# EAGLE design fat-mic-array (EAGLE 7.5.0)
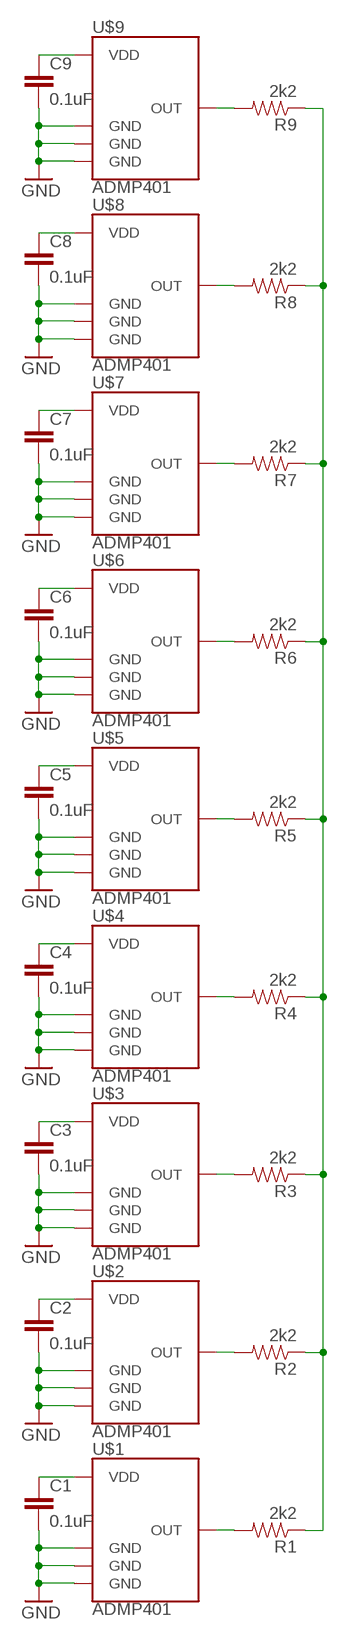
[diagram p0: schematic, sheet 1]

## Parts
C1  0.1uF  0.1UF-16V(+-10%)(0402)  [0402-CAP]
C2  0.1uF  0.1UF-16V(+-10%)(0402)  [0402-CAP]
C3  0.1uF  0.1UF-16V(+-10%)(0402)  [0402-CAP]
C4  0.1uF  0.1UF-16V(+-10%)(0402)  [0402-CAP]
C5  0.1uF  0.1UF-16V(+-10%)(0402)  [0402-CAP]
C6  0.1uF  0.1UF-16V(+-10%)(0402)  [0402-CAP]
C7  0.1uF  0.1UF-16V(+-10%)(0402)  [0402-CAP]
C8  0.1uF  0.1UF-16V(+-10%)(0402)  [0402-CAP]
C9  0.1uF  0.1UF-16V(+-10%)(0402)  [0402-CAP]
R1  2k2  RESISTOR0402-RES  [0402-RES]
R2  2k2  RESISTOR0402-RES  [0402-RES]
R3  2k2  RESISTOR0402-RES  [0402-RES]
R4  2k2  RESISTOR0402-RES  [0402-RES]
R5  2k2  RESISTOR0402-RES  [0402-RES]
R6  2k2  RESISTOR0402-RES  [0402-RES]
R7  2k2  RESISTOR0402-RES  [0402-RES]
R8  2k2  RESISTOR0402-RES  [0402-RES]
R9  2k2  RESISTOR0402-RES  [0402-RES]
U$1  ADMP401  [ADMP401]
U$2  ADMP401  [ADMP401]
U$3  ADMP401  [ADMP401]
U$4  ADMP401  [ADMP401]
U$5  ADMP401  [ADMP401]
U$6  ADMP401  [ADMP401]
U$7  ADMP401  [ADMP401]
U$8  ADMP401  [ADMP401]
U$9  ADMP401  [ADMP401]

## Nets
GND: C1.2 C2.2 C3.2 C4.2 C5.2 C6.2 C7.2 C8.2 C9.2 U$1.2(GND) U$1.4(GND) U$1.6(GND) U$2.2(GND) U$2.4(GND) U$2.6(GND) U$3.2(GND) U$3.4(GND) U$3.6(GND) U$4.2(GND) U$4.4(GND) U$4.6(GND) U$5.2(GND) U$5.4(GND) U$5.6(GND) U$6.2(GND) U$6.4(GND) U$6.6(GND) U$7.2(GND) U$7.4(GND) U$7.6(GND) U$8.2(GND) U$8.4(GND) U$8.6(GND) U$9.2(GND) U$9.4(GND) U$9.6(GND)
N$1: R1.2 U$1.1(OUT)
N$2: C1.1 U$1.5(VDD)
N$3: R3.2 U$3.1(OUT)
N$4: R1.1 R2.1 R3.1 R4.1 R5.1 R6.1 R7.1 R8.1 R9.1
N$5: R2.2 U$2.1(OUT)
N$6: C2.1 U$2.5(VDD)
N$8: C3.1 U$3.5(VDD)
N$10: R4.2 U$4.1(OUT)
N$11: C4.1 U$4.5(VDD)
N$13: R5.2 U$5.1(OUT)
N$14: C5.1 U$5.5(VDD)
N$16: R6.2 U$6.1(OUT)
N$17: C6.1 U$6.5(VDD)
N$18: R7.2 U$7.1(OUT)
N$19: C7.1 U$7.5(VDD)
N$20: R8.2 U$8.1(OUT)
N$21: C8.1 U$8.5(VDD)
N$22: R9.2 U$9.1(OUT)
N$23: C9.1 U$9.5(VDD)

## Library data of the parts
C1-C9 = SparkFun-Capacitors:0.1UF-16V(+-10%)(0402); PROD_ID: CAP-12416
R1-R9 = SparkFun-Passives:RESISTOR: Resistor Basic schematic elements and footprints for 0603, 1206, and PTH resistors.
U$1-U$9 = SparkFun-Sensors:ADMP401: Omnidirection bottom-port MEMS microphone

## Board
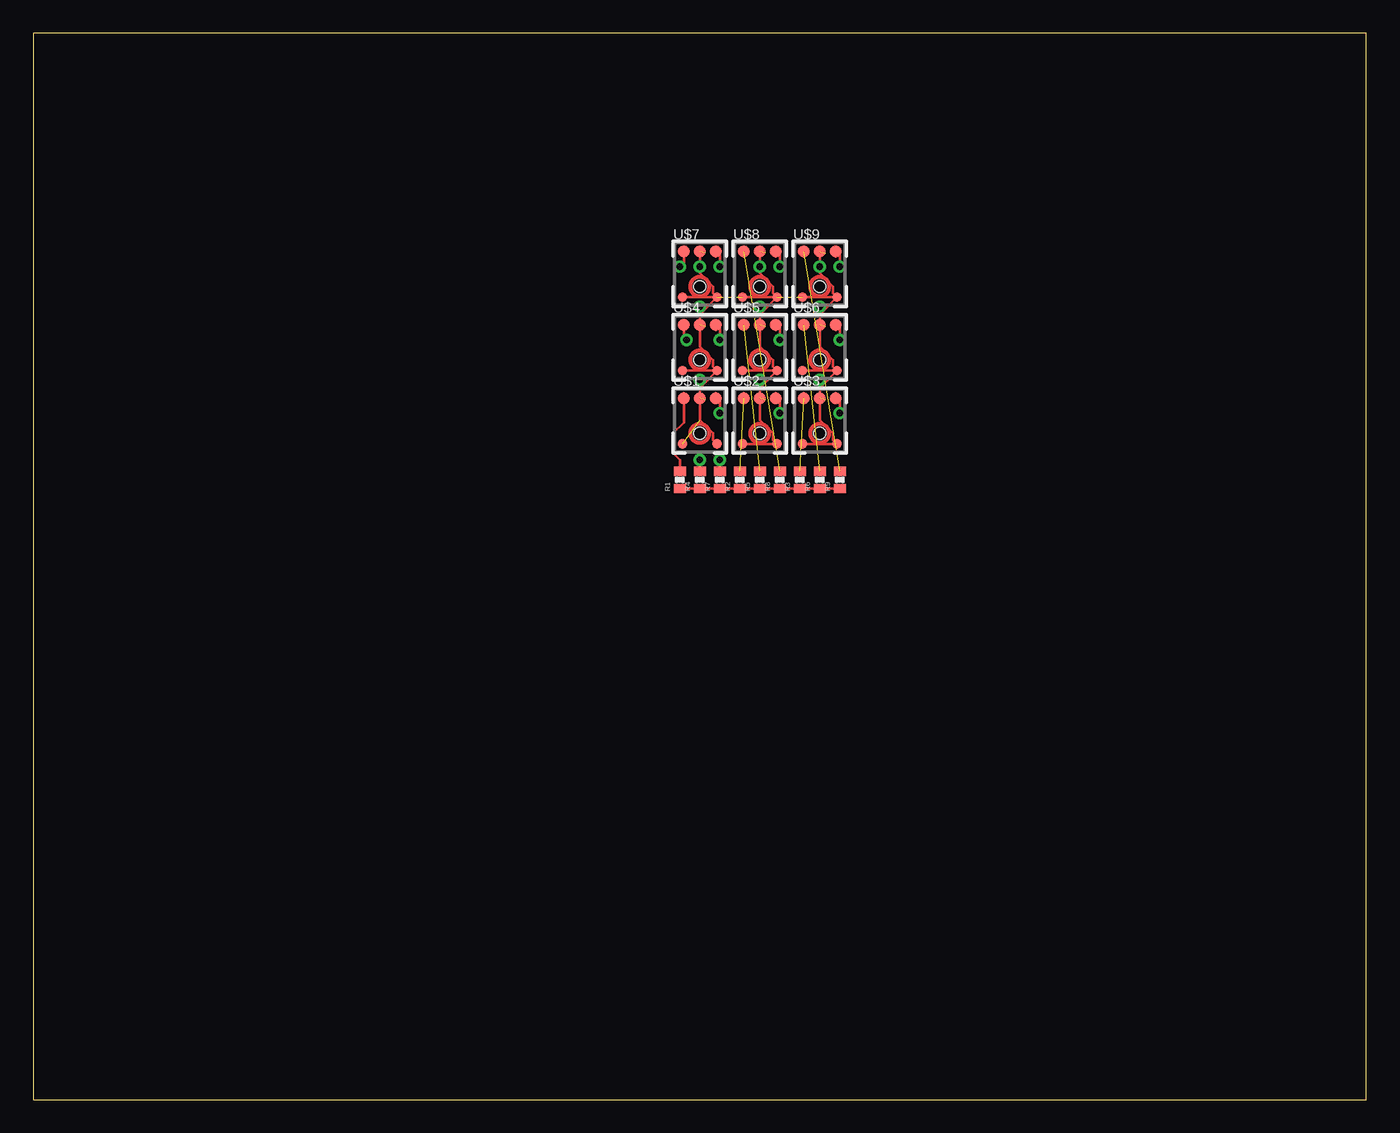
[diagram p1: board, top side]
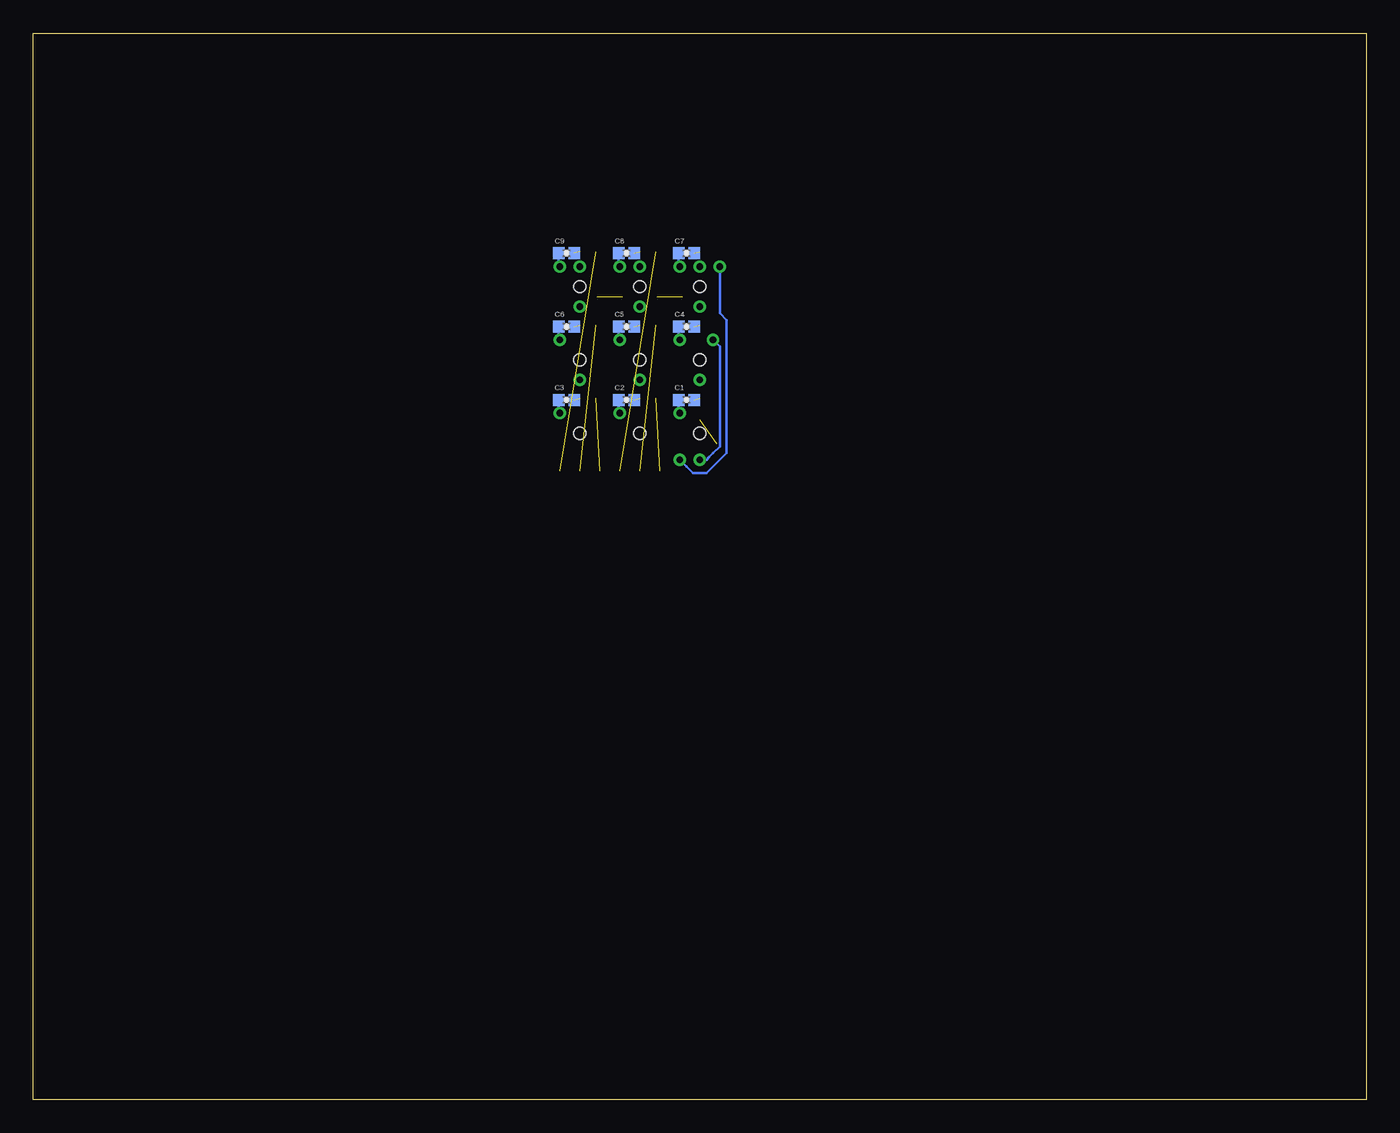
[diagram p2: board, bottom side, seen from below]

Size 100 x 80 mm. Coordinates in mm from the lower left corner, seen from the top.
Outline: 0,0 100,0 100,80 0,80 0,0
Copper layers (1*16): Top 0.035mm / dielectric 1.5mm / Bottom 0.035mm
Design rules "default": minimum track width 10mil, minimum drill 24mil, track to track 8mil, track to pad 8mil, pad to pad 8mil, via to via 8mil, smd to smd 8mil, copper to edge 40mil, drill to drill 8mil, minimum pad ring 10mil, minimum via ring 8mil, stop-mask expansion 4mil, vias tented up to drill 0mil, thermal gap 10mil

### Footprints (pad centres in the part's own frame; a part is rotated, then mirrored left to right if it is on the bottom)
0402-CAP = smd 0.85 x 0.9: 1 -0.58,0; 2 0.58,0
0402-RES = smd 0.7 x 0.9: 1 -0.65,0; 2 0.65,0
ADMP401 = smd 0.9 x 0.9: 1 -1.2,2.62; 5 1.2,2.62; 6 0,2.62 | smd 0.7 x 0.7: 2 1.3,-0.8; 4 -1.3,-0.8 | hole 0.9: 0,0

### Placement (x,y rotation side)
C1  51,52.5 0 bottom
C2  55.5,52.5 0 bottom
C3  60,52.5 0 bottom
C4  51,58 0 bottom
C5  55.5,58 0 bottom
C6  60,58 0 bottom
C7  51,63.5 0 bottom
C8  55.5,63.5 0 bottom
C9  60,63.5 0 bottom
R1  48.5,46.5 90 top
R2  53,46.5 90 top
R3  57.5,46.5 90 top
R4  50,46.5 90 top
R5  54.5,46.5 90 top
R6  59,46.5 90 top
R7  51.5,46.5 90 top
R8  56,46.5 90 top
R9  60.5,46.5 90 top
U$1  50,50 0 top
U$2  54.5,50 0 top
U$3  59,50 0 top
U$4  50,55.5 0 top
U$5  54.5,55.5 0 top
U$6  59,55.5 0 top
U$7  50,61 0 top
U$8  54.5,61 0 top
U$9  59,61 0 top

### Tracks (layer width: path | path; a pad name or v marks a point on that pad's centre or on a via)
GND  (via drill 0.51)  (12 unrouted)
  Top 0.178: U$7.4 U$7.2 | U$8.4 U$8.2 | U$4.4 U$4.2 | U$2.4 U$2.2 55.5,49.5 55.5,50 54.5,51 U$2.6 | U$3.4 U$3.2 60,49.5 60,50 59,51 U$3.6 | U$6.2 U$6.4 | U$9.2 U$9.4 | U$5.2 U$5.4 | v50,62.5 U$7.6 v50,62.5 | v50,62.5 50,62 51,61 51,60.5 U$7.2 | v54.5,62.5 U$8.6 v54.5,62.5 | v54.5,62.5 54.5,62 55.5,61 55.5,60.5 U$8.2 | v59,62.5 U$9.6 v59,62.5 | v59,62.5 59,62 60,61 60,60.5 U$9.2 | U$6.6 59,56.5 60,55.5 60,55 U$6.2 | U$5.6 54.5,56.5 55.5,55.5 55.5,55 U$5.2 | U$4.6 50,56.5 51,55.5 51,55 U$4.2 | U$1.6 50,51 51,50 51,49.5 U$1.2 | U$4.2 50,53.4 U$1.6 | U$5.2 54.5,53.4 U$2.6 | U$6.2 59,53.4 U$3.6 | U$9.2 59,58.9 U$6.6 | U$8.2 54.5,58.9 U$5.6 | U$7.2 50,58.9 U$4.6 | U$1.6 v50,54 | U$2.6 v54.5,54 | U$3.6 v59,54 | U$6.6 v59,59.5 | U$5.6 v54.5,59.5 | U$4.6 v50,59.5
N$1
  Top 0.178: U$1.1 48.8,50.8 48,50 48,48.5 48.5,48 R1.2
N$2  (via drill 0.51)
  Top 0.178: U$1.5 51.5,52.32 v51.5,51.5
  Bottom 0.178: v51.5,51.5 51.58,51.58 C1.1
N$3  (1 unrouted)
N$4
  Top 0.178: R1.1 R4.1 R7.1 R2.1 R5.1 R8.1 R3.1 R6.1 R9.1
N$5  (1 unrouted)
N$6  (via drill 0.51)
  Top 0.178: U$2.5 56,52.32 v56,51.5
  Bottom 0.178: v56,51.5 56.08,51.58 C2.1
N$8  (via drill 0.51)
  Top 0.178: U$3.5 60.5,52.32 v60.5,51.5
  Bottom 0.178: v60.5,51.5 60.58,51.58 C3.1
N$10  (via drill 0.51)
  Top 0.178: U$4.1 48.8,57.3 48.8,57.2 v49,57 | v50,48 R4.2
  Bottom 0.178: v49,57 48.5,56.5 48.5,50.5 48.5,49 49,48.5 49.3,48.2 49.5,48 v50,48
N$11  (via drill 0.51)
  Top 0.178: U$4.5 51.5,57.82 v51.5,57
  Bottom 0.178: v51.5,57 51.58,57.08 C4.1
N$13  (1 unrouted)
N$14  (via drill 0.51)
  Top 0.178: U$5.5 56,57.82 v56,57
  Bottom 0.178: v56,57 56.08,57.08 C5.1
N$16  (1 unrouted)
N$17  (via drill 0.51)
  Top 0.178: U$6.5 60.5,57.82 v60.5,57
  Bottom 0.178: v60.5,57 60.58,57.08 C6.1
N$18  (via drill 0.51)
  Top 0.178: U$7.1 48.8,62.8 v48.5,62.5 | v51.5,48 R7.2
  Bottom 0.178: v48.5,62.5 48.5,59 48,58.5 48,48.5 49.5,47 50.5,47 51,47.5 v51.5,48
N$19  (via drill 0.51)
  Top 0.178: U$7.5 51.5,63.32 v51.5,62.5
  Bottom 0.178: v51.5,62.5 51.58,62.58 C7.1
N$20  (1 unrouted)
N$21  (via drill 0.51)
  Top 0.178: U$8.5 56,63.32 v56,62.5
  Bottom 0.178: v56,62.5 56.08,62.58 C8.1
N$22  (1 unrouted)
N$23  (via drill 0.51)
  Top 0.178: U$9.5 60.5,63.32 v60.5,62.5
  Bottom 0.178: v60.5,62.5 60.58,62.58 C9.1